# Altium schematic sheet LCD_RGB.SchDoc
size A3
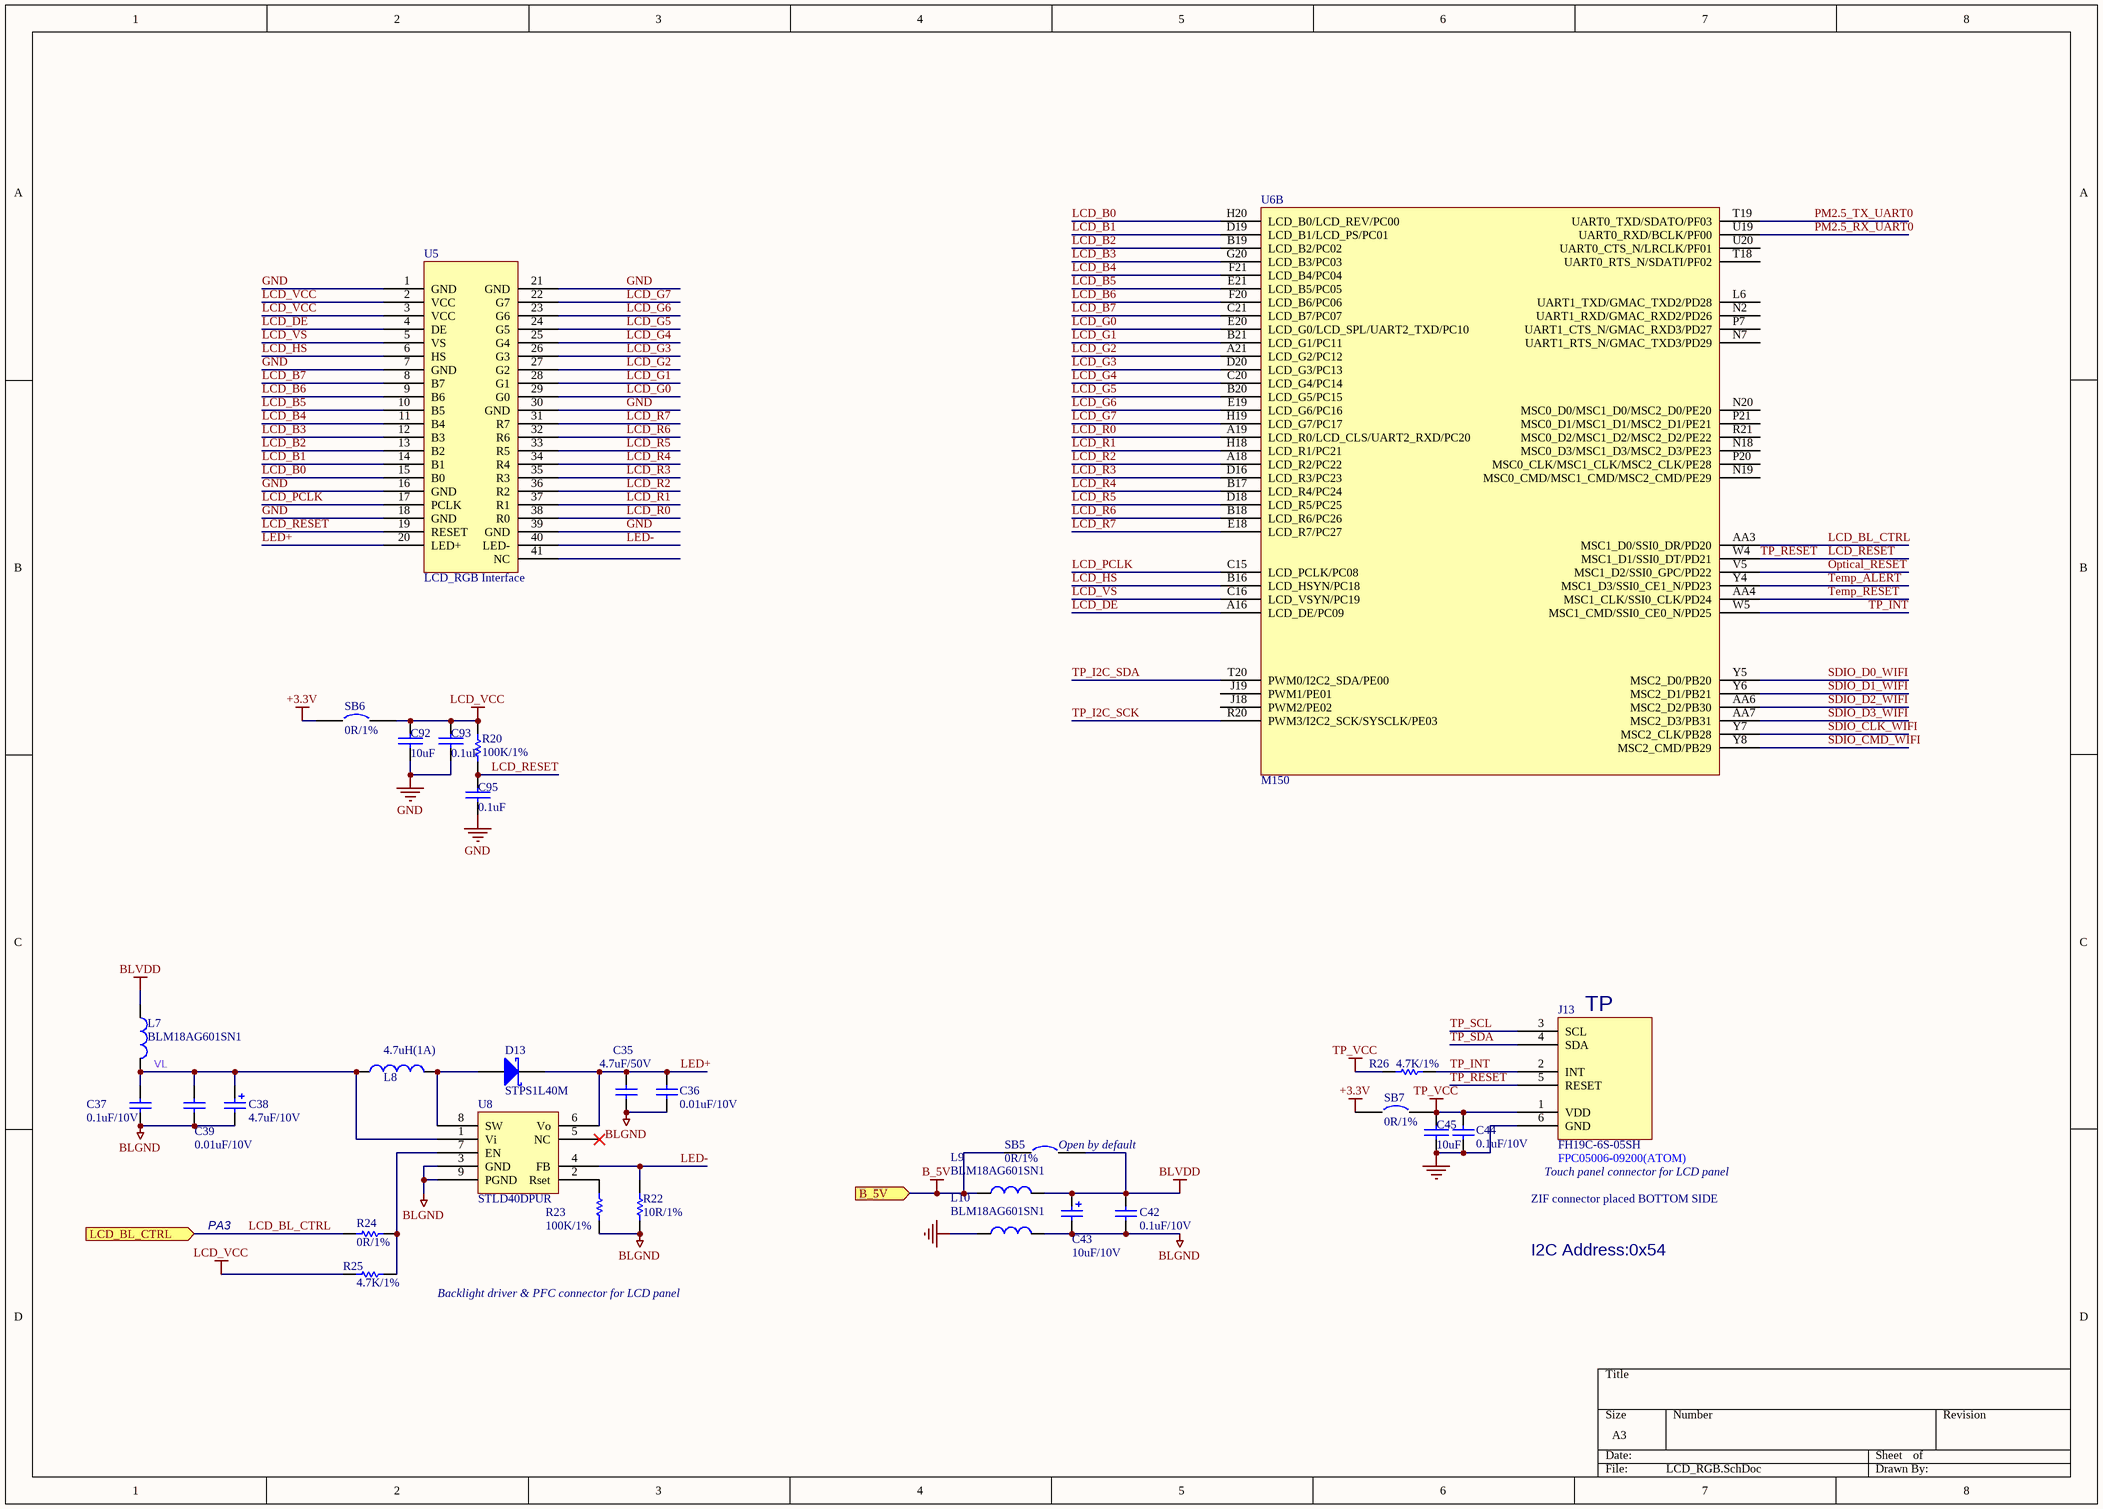
[diagram p0: LCD_RGB.SchDoc]

## Parts
C35  4.7uF/50V  [0603C]
C36  0.01uF/10V  [0402C]
C37  0.1uF/10V  [0402C]
C38  4.7uF/10V  [1206]
C39  0.01uF/10V  [0402C]
C42  0.1uF/10V  [0402C]
C43  10uF/10V  [TAN-A]
C44  0.1uF/10V  [0402C]
C45  10uF  [0402C]
C92  10uF  [0402C]
C93  0.1uF  [0402C]
C95  0.1uF  [0402C]
D13  STPS1L40M  [DO-216AA]
J13  FH19C-6S-05SH  [FH19C-6S-0R5SH_FPC_CPT]
L7  BLM18AG601SN1  [0603R]
L8  4.7uH(1A)  [1210L]
L9  BLM18AG601SN1  [0603R]
L10  BLM18AG601SN1  [0603R]
R20  100K/1%  [0402R]
R22  10R/1%  [0603R]
R23  100K/1%  [0402R]
R24  0R/1%  [0603R]
R25  4.7K/1%  [0402R]
R26  4.7K/1%  [0402R]
SB5  0R/1%  [SB_0603]
SB6  0R/1%  [SB_0603]
SB7  0R/1%  [SB_0603]
U5  LCD_RGB Interface
U6  M150  [Model Name]  (part B of 4)
U8  STLD40DPUR  [SON8_0R65_3X3]

## Ports
B_5V (in), LCD_BL_CTRL (in)

## Nets
+3.3V: SB6.1 SB7.1
B_5V: L9.1 SB5.1 ; port B_5V
BLGND: C35.2 C36.1 C37.1 C38.2 C39.1 C42.2 C43.2 L10.2 R22.1 R23.2 U8.3(GND) U8.9(PGND)
BLVDD: C42.1 C43.1 L7.1 L9.2 SB5.2
GND: C44.1 C45.1 C92.1 C93.1 C95.1 J13.6(GND) L10.1 U5.1(GND) U5.7(GND) U5.16(GND) U5.18(GND) U5.21(GND) U5.30(GND) U5.39(GND)
LCD_VCC: C92.2 C93.2 R20.1 R25.2 SB6.2 U5.2(VCC) U5.3(VCC)
TP_VCC: C44.2 C45.2 J13.1(VDD) R26.1 SB7.2
LCD_B0: U5.15(B0) U6.H20(LCD_B0/LCD_REV/PC00)
LCD_B1: U5.14(B1) U6.D19(LCD_B1/LCD_PS/PC01)
LCD_B2: U5.13(B2) U6.B19(LCD_B2/PC02)
LCD_B3: U5.12(B3) U6.G20(LCD_B3/PC03)
LCD_B4: U5.11(B4) U6.F21(LCD_B4/PC04)
LCD_B5: U5.10(B5) U6.E21(LCD_B5/PC05)
LCD_B6: U5.9(B6) U6.F20(LCD_B6/PC06)
LCD_B7: U5.8(B7) U6.C21(LCD_B7/PC07)
LCD_BL_CTRL: R24.2 U6.AA3(MSC1_D0/SSI0_DR/PD20) ; port LCD_BL_CTRL
LCD_DE: U5.4(DE) U6.A16(LCD_DE/PC09)
LCD_G0: U5.29(G0) U6.E20(LCD_G0/LCD_SPL/UART2_TXD/PC10)
LCD_G1: U5.28(G1) U6.B21(LCD_G1/PC11)
LCD_G2: U5.27(G2) U6.A21(LCD_G2/PC12)
LCD_G3: U5.26(G3) U6.D20(LCD_G3/PC13)
LCD_G4: U5.25(G4) U6.C20(LCD_G4/PC14)
LCD_G5: U5.24(G5) U6.B20(LCD_G5/PC15)
LCD_G6: U5.23(G6) U6.E19(LCD_G6/PC16)
LCD_G7: U5.22(G7) U6.H19(LCD_G7/PC17)
LCD_HS: U5.6(HS) U6.B16(LCD_HSYN/PC18)
LCD_PCLK: U5.17(PCLK) U6.C15(LCD_PCLK/PC08)
LCD_R0: U5.38(R0) U6.A19(LCD_R0/LCD_CLS/UART2_RXD/PC20)
LCD_R1: U5.37(R1) U6.H18(LCD_R1/PC21)
LCD_R2: U5.36(R2) U6.A18(LCD_R2/PC22)
LCD_R3: U5.35(R3) U6.D16(LCD_R3/PC23)
LCD_R4: U5.34(R4) U6.B17(LCD_R4/PC24)
LCD_R5: U5.33(R5) U6.D18(LCD_R5/PC25)
LCD_R6: U5.32(R6) U6.B18(LCD_R6/PC26)
LCD_R7: U5.31(R7) U6.E18(LCD_R7/PC27)
LCD_RESET: C95.2 J13.5(RESET) R20.2 U5.19(RESET) U6.W4(MSC1_D1/SSI0_DT/PD21)  [also labelled TP_RESET]
LCD_VS: U5.5(VS) U6.C16(LCD_VSYN/PC19)
LED+: C35.1 C36.2 D13.2(K) U5.20(LED+) U8.6(Vo)
LED-: R22.2 U5.40(LED-) U8.4(FB)
Optical_RESET: U6.V5(MSC1_D2/SSI0_GPC/PD22)
PM2.5_RX_UART0: U6.U19(UART0_RXD/BCLK/PF00)
PM2.5_TX_UART0: U6.T19(UART0_TXD/SDATO/PF03)
SDIO_CLK_WIFI: U6.Y7(MSC2_CLK/PB28)
SDIO_CMD_WIFI: U6.Y8(MSC2_CMD/PB29)
SDIO_D0_WIFI: U6.Y5(MSC2_D0/PB20)
SDIO_D1_WIFI: U6.Y6(MSC2_D1/PB21)
SDIO_D2_WIFI: U6.AA6(MSC2_D2/PB30)
SDIO_D3_WIFI: U6.AA7(MSC2_D3/PB31)
Temp_ALERT: U6.Y4(MSC1_D3/SSI0_CE1_N/PD23)
Temp_RESET: U6.AA4(MSC1_CLK/SSI0_CLK/PD24)
TP_I2C_SCK: U6.R20(PWM3/I2C2_SCK/SYSCLK/PE03)
TP_I2C_SDA: U6.T20(PWM0/I2C2_SDA/PE00)
TP_INT: J13.2(INT) R26.2 U6.W5(MSC1_CMD/SSI0_CE0_N/PD25)
TP_SCL: J13.3(SCL)
TP_SDA: J13.4(SDA)
VL: C37.2 C38.1 C39.2 L7.2 L8.1 U8.1(Vi)
NetD13_1: D13.1(A) L8.2 U8.8(SW)
NetR23_1: R23.1 U8.2(Rset)
NetR24_1: R24.1 R25.1 U8.7(EN)

Not connected (* = marked no-connect by the designer): U5 41(NC); U6 J18(PWM2/PE02) J19(PWM1/PE01) L6(UART1_TXD/GMAC_TXD2/PD28) N2(UART1_RXD/GMAC_RXD2/PD26) N7(UART1_RTS_N/GMAC_TXD3/PD29) N18(MSC0_D3/MSC1_D3/MSC2_D3/PE23) N19(MSC0_CMD/MSC1_CMD/MSC2_CMD/PE29) N20(MSC0_D0/MSC1_D0/MSC2_D0/PE20) P7(UART1_CTS_N/GMAC_RXD3/PD27) P20(MSC0_CLK/MSC1_CLK/MSC2_CLK/PE28) P21(MSC0_D1/MSC1_D1/MSC2_D1/PE21) R21(MSC0_D2/MSC1_D2/MSC2_D2/PE22) T18(UART0_RTS_N/SDATI/PF02) U20(UART0_CTS_N/LRCLK/PF01); U8 5(NC)*

## Notes on the sheet
- (near J13) TP
- (near SB5) Open by default
- (near J13) Touch panel connector for LCD panel
- (near J13) FPC05006-09200(ATOM)
- PA3
- I2C Address:0x54
- ZIF connector placed BOTTOM SIDE
- Backlight driver & PFC connector for LCD panel

## Library data of the parts
C35 C36 C39 = CAP: 厂家：Murata，型号：; Value: 100pF; Ordered by: Subcon; Published: 8-Jun-2000; Revision: July-2002: Re-released for DXP Platform.; Publisher: Altium Limited
C37 C44 = CAP: Capacitor; Value: 100pF; Ordered by: Subcon; Published: 8-Jun-2000; Revision: July-2002: Re-released for DXP Platform.; Publisher: Altium Limited
C38 = Cap Pol1: Value: 100pF; Ordered by: Subcon; Published: 8-Jun-2000; Revision: July-2002: Re-released for DXP Platform.; Publisher: Altium Limited
C42 = Cap: Capacitor; Value: 10nF; Ordered by: Subcon; Published: 8-Jun-2000; Revision: July-2002: Re-released for DXP Platform.; Publisher: Altium Limited
C43 = Cap Pol1: Polarized Capacitor (Radial); Value: 10uF; Ordered by: Subcon; Published: 8-Jun-2000; Revision: July-2002: Re-released for DXP Platform.; Publisher: Altium Limited
C45 C92 C93 C95 = CAP: 厂家：Murata，型号：GRM1555C1H120JA01D
D13 = D Schottky: Schottky Diode; Code - JEDEC: DO-214-AA; Ordered by: ST; Ref St: 9151085; ECCN_US/EU: EAR99/NEC; Published: 8-Jun-2000; Revision: July-2002: Re-released for DXP Platform.; Publisher: Altium Limited; Manuf_1: ST; Manuf_Part_1: STPS1L40M
J13 = FH19C-6S-05SH: ZIF connector placed bottom side; Manuf_1: ATOM; Manuf_2: Hirose; Manuf_Part_1: FPC05006-09200; Ordered by: Subcon; Silkscreen: TS; Manuf_Part_2: FH19C-6S-05SH
L7 L9 L10 = CHOKE: 厂家：MURATA，型号：BLM18AG601SN1
L8 = Inductor: Value: 100uH; Ordered by: Subcon; Published: 8-Jun-2000; Revision: July-2002: Re-released for DXP Platform.; Publisher: Altium Limited
R20 R22 R23 = Res1: Resistor; Value: 1K; Ordered by: Subcon; Published: 8-Jun-2000; Revision: July-2002: Re-released for DXP Platform.; Publisher: Altium Limited
R24 = Res1: Resistor; Value: 1K; Ordered by: Subcon; Fitted: NO; Published: 8-Jun-2000; Revision: July-2002: Re-released for DXP Platform.; Publisher: Altium Limited
R25 R26 = Res1: 厂家：Yageo，型号：; Value: 1K; Ordered by: Subcon; Published: 8-Jun-2000; Revision: July-2002: Re-released for DXP Platform.; Publisher: Altium Limited
SB5-SB7 = Circuit Breaker: Ordered by: Subcon; Comments: Solder bridge; Fitted: NO; Published: 24-Mar-1999; Revision: July-2002: Re-released for DXP Platform.; Publisher: Altium Limited
U8 = STLD40DPMR: Ordered by: ST; Ref St: 9176009; ECCN_US/EU: EAR99/NEC; Manuf_1: ST; Manuf_Part_1: STLD40DPUR